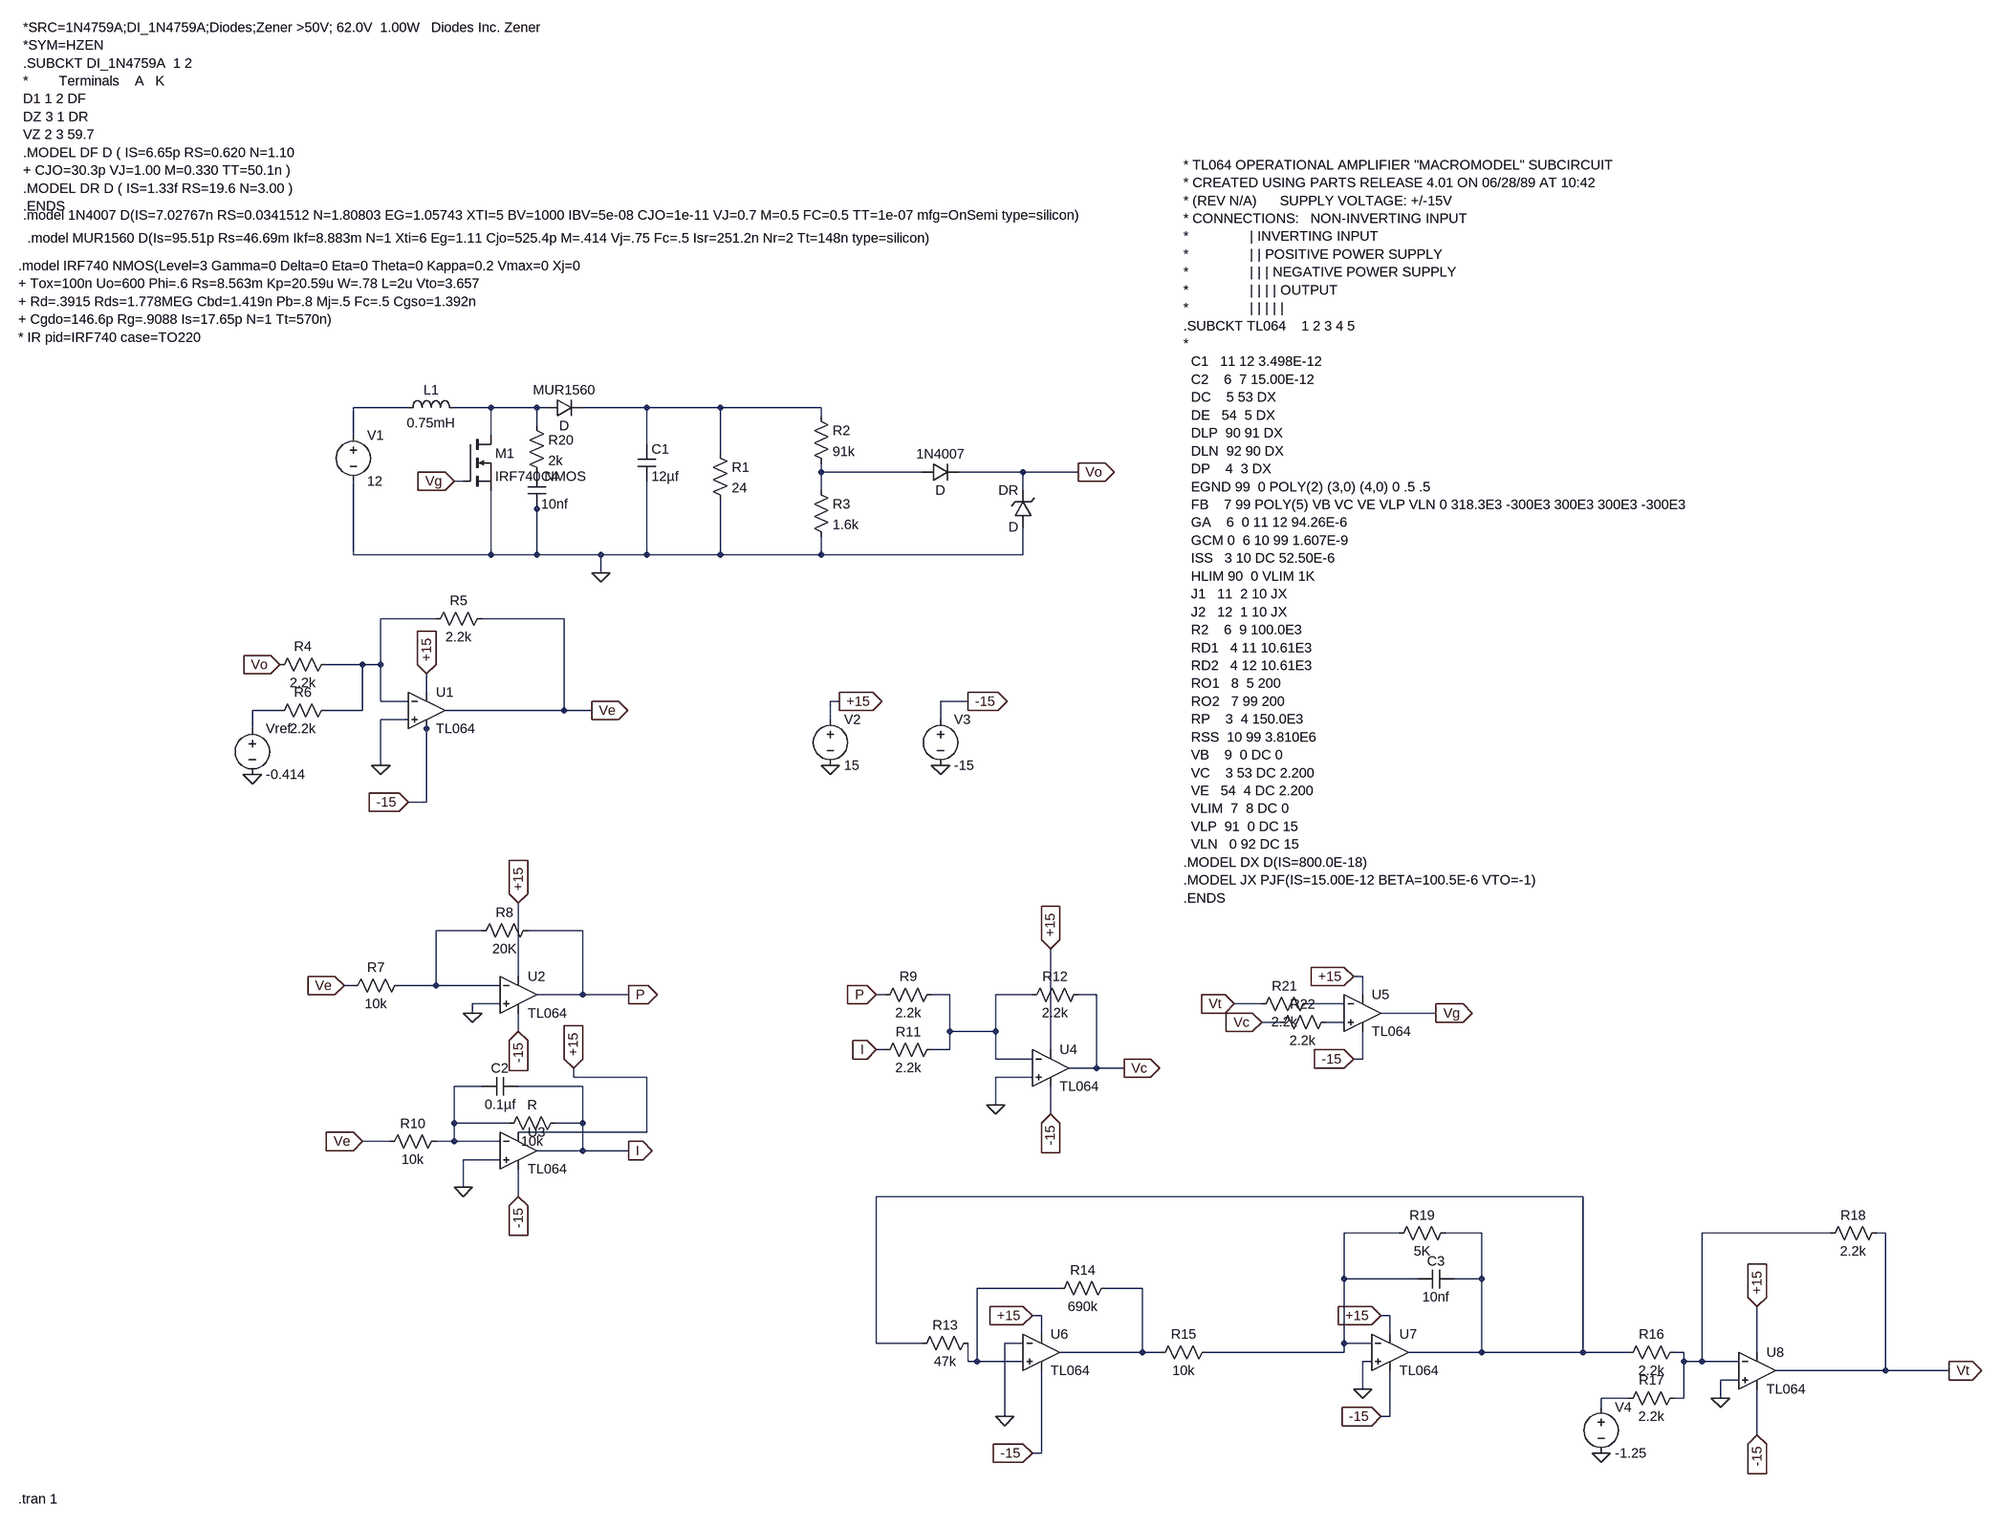
[diagram p0: schematic CLBC.asc]
CLBC.asc, the LTspice schematic file:
Version 4
SHEET 1 2676 1984
WIRE -128 64 -224 64
WIRE 16 64 -48 64
WIRE 96 64 16 64
WIRE 112 64 96 64
WIRE 288 64 176 64
WIRE 416 64 288 64
WIRE 592 64 416 64
WIRE 592 80 592 64
WIRE 96 96 96 64
WIRE -224 112 -224 64
WIRE 16 112 16 64
WIRE 288 128 288 64
WIRE 416 144 416 64
WIRE 592 176 592 160
WIRE 768 176 592 176
WIRE 944 176 832 176
WIRE 1040 176 944 176
WIRE -32 192 -48 192
WIRE 592 208 592 176
WIRE 944 208 944 176
WIRE 96 240 96 224
WIRE -224 320 -224 192
WIRE 16 320 16 208
WIRE 16 320 -224 320
WIRE 96 320 96 240
WIRE 96 320 16 320
WIRE 208 320 96 320
WIRE 288 320 288 192
WIRE 288 320 208 320
WIRE 416 320 416 224
WIRE 416 320 288 320
WIRE 592 320 592 288
WIRE 592 320 416 320
WIRE 944 320 944 272
WIRE 944 320 592 320
WIRE 208 352 208 320
WIRE -80 432 -176 432
WIRE 144 432 0 432
WIRE -208 512 -272 512
WIRE -176 512 -176 432
WIRE -176 512 -208 512
WIRE -96 560 -96 528
WIRE -176 576 -176 512
WIRE -128 576 -176 576
WIRE 624 576 608 576
WIRE 848 576 800 576
WIRE -352 592 -400 592
WIRE -208 592 -208 512
WIRE -208 592 -272 592
WIRE 144 592 144 432
WIRE 144 592 -64 592
WIRE 192 592 144 592
WIRE -128 608 -176 608
WIRE 608 608 608 576
WIRE 800 608 800 576
WIRE -400 624 -400 592
WIRE -96 624 -96 608
WIRE -176 688 -176 608
WIRE -96 752 -96 624
WIRE -96 752 -128 752
WIRE 0 976 -80 976
WIRE 176 976 80 976
WIRE 64 1056 64 928
WIRE 1536 1056 1520 1056
WIRE -224 1072 -240 1072
WIRE -80 1072 -80 976
WIRE -80 1072 -144 1072
WIRE 32 1072 -80 1072
WIRE 176 1088 176 976
WIRE 176 1088 96 1088
WIRE 256 1088 176 1088
WIRE 704 1088 688 1088
WIRE 816 1088 784 1088
WIRE 960 1088 896 1088
WIRE 1072 1088 1040 1088
WIRE 1536 1088 1536 1056
WIRE 32 1104 -16 1104
WIRE 1360 1104 1312 1104
WIRE 1504 1104 1440 1104
WIRE -16 1120 -16 1104
WIRE 1664 1120 1568 1120
WIRE 1392 1136 1360 1136
WIRE 1504 1136 1472 1136
WIRE 64 1152 64 1120
WIRE 816 1152 816 1088
WIRE 896 1152 896 1088
WIRE 896 1152 816 1152
WIRE 704 1184 688 1184
WIRE 816 1184 816 1152
WIRE 816 1184 784 1184
WIRE 992 1184 992 1008
WIRE 896 1200 896 1152
WIRE 960 1200 896 1200
WIRE 1536 1200 1536 1152
WIRE 1536 1200 1520 1200
WIRE 1072 1216 1072 1088
WIRE 1072 1216 1024 1216
WIRE 1120 1216 1072 1216
WIRE 160 1232 160 1216
WIRE 288 1232 160 1232
WIRE 960 1232 896 1232
WIRE 0 1248 -48 1248
WIRE 176 1248 64 1248
WIRE 896 1280 896 1232
WIRE 992 1296 992 1248
WIRE -48 1312 -48 1248
WIRE 48 1312 -48 1312
WIRE 176 1312 176 1248
WIRE 176 1312 128 1312
WIRE 288 1328 288 1232
WIRE 288 1328 64 1328
WIRE -160 1344 -208 1344
WIRE -48 1344 -48 1312
WIRE -48 1344 -80 1344
WIRE 32 1344 -48 1344
WIRE 176 1360 176 1312
WIRE 176 1360 96 1360
WIRE 256 1360 176 1360
WIRE 32 1376 -32 1376
WIRE -32 1424 -32 1376
WIRE 64 1440 64 1392
WIRE 1920 1440 688 1440
WIRE 1600 1504 1504 1504
WIRE 1744 1504 1680 1504
WIRE 2352 1504 2128 1504
WIRE 2448 1504 2432 1504
WIRE 1504 1584 1504 1504
WIRE 1632 1584 1504 1584
WIRE 1744 1584 1744 1504
WIRE 1744 1584 1696 1584
WIRE 1008 1600 864 1600
WIRE 1152 1600 1088 1600
WIRE 976 1648 960 1648
WIRE 1584 1648 1568 1648
WIRE 976 1680 976 1648
WIRE 1584 1680 1584 1648
WIRE 688 1696 688 1440
WIRE 768 1696 688 1696
WIRE 944 1696 912 1696
WIRE 1504 1696 1504 1584
WIRE 1552 1696 1504 1696
WIRE 1152 1712 1152 1600
WIRE 1152 1712 1008 1712
WIRE 1184 1712 1152 1712
WIRE 1504 1712 1504 1696
WIRE 1504 1712 1264 1712
WIRE 1744 1712 1744 1584
WIRE 1744 1712 1616 1712
WIRE 1920 1712 1920 1440
WIRE 1920 1712 1744 1712
WIRE 2000 1712 1920 1712
WIRE 2096 1712 2080 1712
WIRE 2224 1712 2224 1632
WIRE 848 1728 848 1696
WIRE 864 1728 864 1600
WIRE 864 1728 848 1728
WIRE 944 1728 864 1728
WIRE 1552 1728 1536 1728
WIRE 2096 1728 2096 1712
WIRE 2128 1728 2128 1504
WIRE 2128 1728 2096 1728
WIRE 2192 1728 2128 1728
WIRE 2448 1744 2448 1504
WIRE 2448 1744 2256 1744
WIRE 2592 1744 2448 1744
WIRE 2192 1760 2160 1760
WIRE 1536 1776 1536 1728
WIRE 2000 1792 1952 1792
WIRE 2096 1792 2096 1728
WIRE 2096 1792 2080 1792
WIRE 2160 1792 2160 1760
WIRE 1952 1808 1952 1792
WIRE 912 1824 912 1696
WIRE 1584 1824 1584 1744
WIRE 1584 1824 1568 1824
WIRE 2224 1856 2224 1776
WIRE 976 1888 976 1744
WIRE 976 1888 960 1888
FLAG -176 688 0
FLAG 1040 176 Vo
IOPIN 1040 176 Out
FLAG -352 512 Vo
IOPIN -352 512 In
FLAG -400 704 0
FLAG 192 592 Ve
IOPIN 192 592 Out
FLAG -240 1072 Ve
IOPIN -240 1072 In
FLAG -16 1120 0
FLAG 256 1088 P
IOPIN 256 1088 Out
FLAG -32 1424 0
FLAG -208 1344 Ve
IOPIN -208 1344 In
FLAG 256 1360 I
IOPIN 256 1360 Out
FLAG 688 1088 P
IOPIN 688 1088 In
FLAG 688 1184 I
IOPIN 688 1184 In
FLAG 896 1280 0
FLAG 1120 1216 Vc
IOPIN 1120 1216 Out
FLAG 1360 1136 Vc
IOPIN 1360 1136 In
FLAG 1312 1104 Vt
IOPIN 1312 1104 In
FLAG 608 688 0
FLAG 800 688 0
FLAG 624 576 +15
IOPIN 624 576 Out
FLAG 848 576 -15
IOPIN 848 576 Out
FLAG -96 528 +15
IOPIN -96 528 In
FLAG 64 928 +15
IOPIN 64 928 In
FLAG 160 1216 +15
IOPIN 160 1216 In
FLAG 992 1008 +15
IOPIN 992 1008 In
FLAG 1520 1056 +15
IOPIN 1520 1056 In
FLAG -128 752 -15
IOPIN -128 752 In
FLAG 64 1152 -15
IOPIN 64 1152 In
FLAG 64 1440 -15
IOPIN 64 1440 In
FLAG 992 1296 -15
IOPIN 992 1296 In
FLAG 1520 1200 -15
IOPIN 1520 1200 In
FLAG 1664 1120 Vg
IOPIN 1664 1120 Out
FLAG 912 1824 0
FLAG 208 352 0
FLAG -48 192 Vg
IOPIN -48 192 In
FLAG 960 1648 +15
IOPIN 960 1648 In
FLAG 1568 1648 +15
IOPIN 1568 1648 In
FLAG 1568 1824 -15
IOPIN 1568 1824 In
FLAG 960 1888 -15
IOPIN 960 1888 In
FLAG 1536 1776 0
FLAG 1952 1888 0
FLAG 2160 1792 0
FLAG 2224 1632 +15
IOPIN 2224 1632 In
FLAG 2224 1856 -15
IOPIN 2224 1856 In
FLAG 2592 1744 Vt
IOPIN 2592 1744 Out
SYMBOL voltage -224 96 R0
WINDOW 123 0 0 Left 0
WINDOW 39 0 0 Left 0
SYMATTR InstName V1
SYMATTR Value 12
SYMBOL ind -144 80 R270
WINDOW 0 32 56 VTop 2
WINDOW 3 5 56 VBottom 2
SYMATTR InstName L1
SYMATTR Value 0.75mH
SYMBOL nmos -32 112 R0
SYMATTR InstName M1
SYMATTR Value IRF740 NMOS
SYMBOL diode 112 80 R270
WINDOW 0 32 32 VTop 2
WINDOW 3 0 32 VBottom 2
SYMATTR InstName MUR1560
SYMBOL cap 272 128 R0
SYMATTR InstName C1
SYMATTR Value 12µf
SYMBOL res 400 128 R0
SYMATTR InstName R1
SYMATTR Value 24
SYMBOL diode 768 192 R270
WINDOW 0 32 32 VTop 2
WINDOW 3 0 32 VBottom 2
SYMATTR InstName 1N4007
SYMBOL zener 960 272 R180
WINDOW 0 24 64 Left 2
WINDOW 3 24 0 Left 2
SYMATTR InstName DR
SYMBOL res 576 64 R0
SYMATTR InstName R2
SYMATTR Value 91k
SYMBOL res 576 192 R0
SYMATTR InstName R3
SYMATTR Value 1.6k
SYMBOL OpAmps\\opamp2 -96 528 R0
SYMATTR InstName U1
SYMATTR Value TL064
SYMBOL res -256 496 R90
WINDOW 0 0 56 VBottom 2
WINDOW 3 32 56 VTop 2
SYMATTR InstName R4
SYMATTR Value 2.2k
SYMBOL res 16 416 R90
WINDOW 0 0 56 VBottom 2
WINDOW 3 32 56 VTop 2
SYMATTR InstName R5
SYMATTR Value 2.2k
SYMBOL res -256 576 R90
WINDOW 0 0 56 VBottom 2
WINDOW 3 32 56 VTop 2
SYMATTR InstName R6
SYMATTR Value 2.2k
SYMBOL voltage -400 608 R0
WINDOW 123 0 0 Left 0
WINDOW 39 0 0 Left 0
SYMATTR InstName Vref
SYMATTR Value -0.414
SYMBOL res -128 1056 R90
WINDOW 0 0 56 VBottom 2
WINDOW 3 32 56 VTop 2
SYMATTR InstName R7
SYMATTR Value 10k
SYMBOL OpAmps\\opamp2 64 1024 R0
SYMATTR InstName U2
SYMATTR Value TL064
SYMBOL res 96 960 R90
WINDOW 0 0 56 VBottom 2
WINDOW 3 32 56 VTop 2
SYMATTR InstName R8
SYMATTR Value 20K
SYMBOL OpAmps\\opamp2 64 1296 R0
SYMATTR InstName U3
SYMATTR Value TL064
SYMBOL res -64 1328 R90
WINDOW 0 0 56 VBottom 2
WINDOW 3 32 56 VTop 2
SYMATTR InstName R10
SYMATTR Value 10k
SYMBOL cap 64 1232 R90
WINDOW 0 0 32 VBottom 2
WINDOW 3 32 32 VTop 2
SYMATTR InstName C2
SYMATTR Value 0.1µf
SYMBOL OpAmps\\opamp2 992 1152 R0
SYMATTR InstName U4
SYMATTR Value TL064
SYMBOL res 800 1072 R90
WINDOW 0 0 56 VBottom 2
WINDOW 3 32 56 VTop 2
SYMATTR InstName R9
SYMATTR Value 2.2k
SYMBOL res 800 1168 R90
WINDOW 0 0 56 VBottom 2
WINDOW 3 32 56 VTop 2
SYMATTR InstName R11
SYMATTR Value 2.2k
SYMBOL res 1056 1072 R90
WINDOW 0 0 56 VBottom 2
WINDOW 3 32 56 VTop 2
SYMATTR InstName R12
SYMATTR Value 2.2k
SYMBOL OpAmps\\opamp2 1536 1056 R0
SYMATTR InstName U5
SYMATTR Value TL064
SYMBOL voltage 608 592 R0
WINDOW 123 0 0 Left 0
WINDOW 39 0 0 Left 0
SYMATTR InstName V2
SYMATTR Value 15
SYMBOL voltage 800 592 R0
WINDOW 123 0 0 Left 0
WINDOW 39 0 0 Left 0
SYMATTR InstName V3
SYMATTR Value -15
SYMBOL OpAmps\\opamp2 976 1648 R0
SYMATTR InstName U6
SYMATTR Value TL064
SYMBOL OpAmps\\opamp2 1584 1648 R0
SYMATTR InstName U7
SYMATTR Value TL064
SYMBOL res 864 1680 R90
WINDOW 0 0 56 VBottom 2
WINDOW 3 32 56 VTop 2
SYMATTR InstName R13
SYMATTR Value 47k
SYMBOL res 1104 1584 R90
WINDOW 0 0 56 VBottom 2
WINDOW 3 32 56 VTop 2
SYMATTR InstName R14
SYMATTR Value 690k
SYMBOL res 1280 1696 R90
WINDOW 0 0 56 VBottom 2
WINDOW 3 32 56 VTop 2
SYMATTR InstName R15
SYMATTR Value 10k
SYMBOL cap 1696 1568 R90
WINDOW 0 0 32 VBottom 2
WINDOW 3 32 32 VTop 2
SYMATTR InstName C3
SYMATTR Value 10nf
SYMBOL res 144 1296 R90
WINDOW 0 0 56 VBottom 2
WINDOW 3 32 56 VTop 2
SYMATTR InstName R
SYMATTR Value 10k
SYMBOL OpAmps\\opamp2 2224 1680 R0
SYMATTR InstName U8
SYMATTR Value TL064
SYMBOL res 2096 1696 R90
WINDOW 0 0 56 VBottom 2
WINDOW 3 32 56 VTop 2
SYMATTR InstName R16
SYMATTR Value 2.2k
SYMBOL res 2096 1776 R90
WINDOW 0 0 56 VBottom 2
WINDOW 3 32 56 VTop 2
SYMATTR InstName R17
SYMATTR Value 2.2k
SYMBOL voltage 1952 1792 R0
WINDOW 123 0 0 Left 0
WINDOW 39 0 0 Left 0
SYMATTR InstName V4
SYMATTR Value -1.25
SYMBOL res 2448 1488 R90
WINDOW 0 0 56 VBottom 2
WINDOW 3 32 56 VTop 2
SYMATTR InstName R18
SYMATTR Value 2.2k
SYMBOL res 1696 1488 R90
WINDOW 0 0 56 VBottom 2
WINDOW 3 32 56 VTop 2
SYMATTR InstName R19
SYMATTR Value 5K
SYMBOL res 80 80 R0
SYMATTR InstName R20
SYMATTR Value 2k
SYMBOL cap 80 176 R0
SYMATTR InstName C4
SYMATTR Value 10nf
SYMBOL res 1456 1088 R90
WINDOW 0 0 56 VBottom 2
WINDOW 3 32 56 VTop 2
SYMATTR InstName R21
SYMATTR Value 2.2k
SYMBOL res 1488 1120 R90
WINDOW 0 0 56 VBottom 2
WINDOW 3 32 56 VTop 2
SYMATTR InstName R22
SYMATTR Value 2.2k
TEXT -808 -184 Left 2 !.model IRF740 NMOS(Level=3 Gamma=0 Delta=0 Eta=0 Theta=0 Kappa=0.2 Vmax=0 Xj=0\n+ Tox=100n Uo=600 Phi=.6 Rs=8.563m Kp=20.59u W=.78 L=2u Vto=3.657\n+ Rd=.3915 Rds=1.778MEG Cbd=1.419n Pb=.8 Mj=.5 Fc=.5 Cgso=1.392n\n+ Cgdo=146.6p Rg=.9088 Is=17.65p N=1 Tt=570n)\n* IR pid=IRF740 case=TO220
TEXT -792 -232 Left 2 !.model MUR1560 D(Is=95.51p Rs=46.69m Ikf=8.883m N=1 Xti=6 Eg=1.11 Cjo=525.4p M=.414 Vj=.75 Fc=.5 Isr=251.2n Nr=2 Tt=148n type=silicon)
TEXT -800 -272 Left 2 !.model 1N4007 D(IS=7.02767n RS=0.0341512 N=1.80803 EG=1.05743 XTI=5 BV=1000 IBV=5e-08 CJO=1e-11 VJ=0.7 M=0.5 FC=0.5 TT=1e-07 mfg=OnSemi type=silicon)
TEXT -800 -600 Left 2 !*SRC=1N4759A;DI_1N4759A;Diodes;Zener >50V; 62.0V  1.00W   Diodes Inc. Zener\n*SYM=HZEN\n.SUBCKT DI_1N4759A  1 2\n*        Terminals    A   K\nD1 1 2 DF\nDZ 3 1 DR\nVZ 2 3 59.7\n.MODEL DF D ( IS=6.65p RS=0.620 N=1.10\n+ CJO=30.3p VJ=1.00 M=0.330 TT=50.1n )\n.MODEL DR D ( IS=1.33f RS=19.6 N=3.00 )\n.ENDS
TEXT 1224 -360 Left 2 !* TL064 OPERATIONAL AMPLIFIER "MACROMODEL" SUBCIRCUIT\n* CREATED USING PARTS RELEASE 4.01 ON 06/28/89 AT 10:42\n* (REV N/A)      SUPPLY VOLTAGE: +/-15V\n* CONNECTIONS:   NON-INVERTING INPUT\n*                | INVERTING INPUT\n*                | | POSITIVE POWER SUPPLY\n*                | | | NEGATIVE POWER SUPPLY\n*                | | | | OUTPUT\n*                | | | | |\n.SUBCKT TL064    1 2 3 4 5\n*\n  C1   11 12 3.498E-12\n  C2    6  7 15.00E-12\n  DC    5 53 DX\n  DE   54  5 DX\n  DLP  90 91 DX\n  DLN  92 90 DX\n  DP    4  3 DX\n  EGND 99  0 POLY(2) (3,0) (4,0) 0 .5 .5\n  FB    7 99 POLY(5) VB VC VE VLP VLN 0 318.3E3 -300E3 300E3 300E3 -300E3\n  GA    6  0 11 12 94.26E-6\n  GCM 0  6 10 99 1.607E-9\n  ISS   3 10 DC 52.50E-6\n  HLIM 90  0 VLIM 1K\n  J1   11  2 10 JX\n  J2   12  1 10 JX\n  R2    6  9 100.0E3\n  RD1   4 11 10.61E3\n  RD2   4 12 10.61E3\n  RO1   8  5 200\n  RO2   7 99 200\n  RP    3  4 150.0E3\n  RSS  10 99 3.810E6\n  VB    9  0 DC 0\n  VC    3 53 DC 2.200\n  VE   54  4 DC 2.200\n  VLIM  7  8 DC 0\n  VLP  91  0 DC 15\n  VLN   0 92 DC 15\n.MODEL DX D(IS=800.0E-18)\n.MODEL JX PJF(IS=15.00E-12 BETA=100.5E-6 VTO=-1)\n.ENDS
TEXT -808 1968 Left 2 !.tran 1

The netlist it stands for:
* CLBC.asc
V1 N001 0 12
L1 N001 N002 0.75mH
M1 N002 Vg 0 0 IRF740 NMOS
D§MUR1560 N002 N003 D
C1 N003 0 12µf
R1 N003 0 24
D§1N4007 N004 Vo D
DR 0 Vo D
R2 N003 N004 91k
R3 N004 0 1.6k
XU1 0 N005 +15 -15 Ve TL064  ; pins In+ In- V+ V- OUT
R4 N005 Vo 2.2k
R5 Ve N005 2.2k
R6 N005 N006 2.2k
Vref N006 0 -0.414
R7 N007 Ve 10k
XU2 0 N007 +15 -15 P TL064  ; pins In+ In- V+ V- OUT
R8 P N007 20K
XU3 0 N011 +15 -15 I TL064  ; pins In+ In- V+ V- OUT
R10 N011 Ve 10k
C2 I N011 0.1µf
XU4 0 N008 +15 -15 Vc TL064  ; pins In+ In- V+ V- OUT
R9 N008 P 2.2k
R11 N008 I 2.2k
R12 Vc N008 2.2k
XU5 N010 N009 +15 -15 Vg TL064  ; pins In+ In- V+ V- OUT
V2 +15 0 15
V3 -15 0 -15
XU6 N015 0 +15 -15 N016 TL064  ; pins In+ In- V+ V- OUT
XU7 0 N013 +15 -15 N012 TL064  ; pins In+ In- V+ V- OUT
R13 N015 N012 47k
R14 N016 N015 690k
R15 N013 N016 10k
C3 N012 N013 10nf
R I N011 10k
XU8 0 N014 +15 -15 Vt TL064  ; pins In+ In- V+ V- OUT
R16 N014 N012 2.2k
R17 N014 N017 2.2k
V4 N017 0 -1.25
R18 Vt N014 2.2k
R19 N012 N013 5K
R20 N002 P001 2k
C4 P001 0 10nf
R21 N009 Vt 2.2k
R22 N010 Vc 2.2k
.model D D
.lib standard.dio
.model NMOS NMOS
.model PMOS PMOS
.lib standard.mos
.model IRF740 NMOS(Level=3 Gamma=0 Delta=0 Eta=0 Theta=0 Kappa=0.2 Vmax=0 Xj=0
+ Tox=100n Uo=600 Phi=.6 Rs=8.563m Kp=20.59u W=.78 L=2u Vto=3.657
+ Rd=.3915 Rds=1.778MEG Cbd=1.419n Pb=.8 Mj=.5 Fc=.5 Cgso=1.392n
+ Cgdo=146.6p Rg=.9088 Is=17.65p N=1 Tt=570n)
* IR pid=IRF740 case=TO220
.model MUR1560 D(Is=95.51p Rs=46.69m Ikf=8.883m N=1 Xti=6 Eg=1.11 Cjo=525.4p M=.414 Vj=.75 Fc=.5 Isr=251.2n Nr=2 Tt=148n type=silicon)
.model 1N4007 D(IS=7.02767n RS=0.0341512 N=1.80803 EG=1.05743 XTI=5 BV=1000 IBV=5e-08 CJO=1e-11 VJ=0.7 M=0.5 FC=0.5 TT=1e-07 mfg=OnSemi type=silicon)
*SRC=1N4759A;DI_1N4759A;Diodes;Zener >50V; 62.0V  1.00W   Diodes Inc. Zener
*SYM=HZEN
.SUBCKT DI_1N4759A  1 2
*        Terminals    A   K
D1 1 2 DF
DZ 3 1 DR
VZ 2 3 59.7
.MODEL DF D ( IS=6.65p RS=0.620 N=1.10
+ CJO=30.3p VJ=1.00 M=0.330 TT=50.1n )
.MODEL DR D ( IS=1.33f RS=19.6 N=3.00 )
.ENDS
* TL064 OPERATIONAL AMPLIFIER "MACROMODEL" SUBCIRCUIT
* CREATED USING PARTS RELEASE 4.01 ON 06/28/89 AT 10:42
* (REV N/A)      SUPPLY VOLTAGE: +/-15V
* CONNECTIONS:   NON-INVERTING INPUT
*                | INVERTING INPUT
*                | | POSITIVE POWER SUPPLY
*                | | | NEGATIVE POWER SUPPLY
*                | | | | OUTPUT
*                | | | | |
.SUBCKT TL064    1 2 3 4 5
*
  C1   11 12 3.498E-12
  C2    6  7 15.00E-12
  DC    5 53 DX
  DE   54  5 DX
  DLP  90 91 DX
  DLN  92 90 DX
  DP    4  3 DX
  EGND 99  0 POLY(2) (3,0) (4,0) 0 .5 .5
  FB    7 99 POLY(5) VB VC VE VLP VLN 0 318.3E3 -300E3 300E3 300E3 -300E3
  GA    6  0 11 12 94.26E-6
  GCM 0  6 10 99 1.607E-9
  ISS   3 10 DC 52.50E-6
  HLIM 90  0 VLIM 1K
  J1   11  2 10 JX
  J2   12  1 10 JX
  R2    6  9 100.0E3
  RD1   4 11 10.61E3
  RD2   4 12 10.61E3
  RO1   8  5 200
  RO2   7 99 200
  RP    3  4 150.0E3
  RSS  10 99 3.810E6
  VB    9  0 DC 0
  VC    3 53 DC 2.200
  VE   54  4 DC 2.200
  VLIM  7  8 DC 0
  VLP  91  0 DC 15
  VLN   0 92 DC 15
.MODEL DX D(IS=800.0E-18)
.MODEL JX PJF(IS=15.00E-12 BETA=100.5E-6 VTO=-1)
.ENDS
.tran 1
.backanno
.end